# EAGLE design SmartBakerySensor (EAGLE 9.6.2)
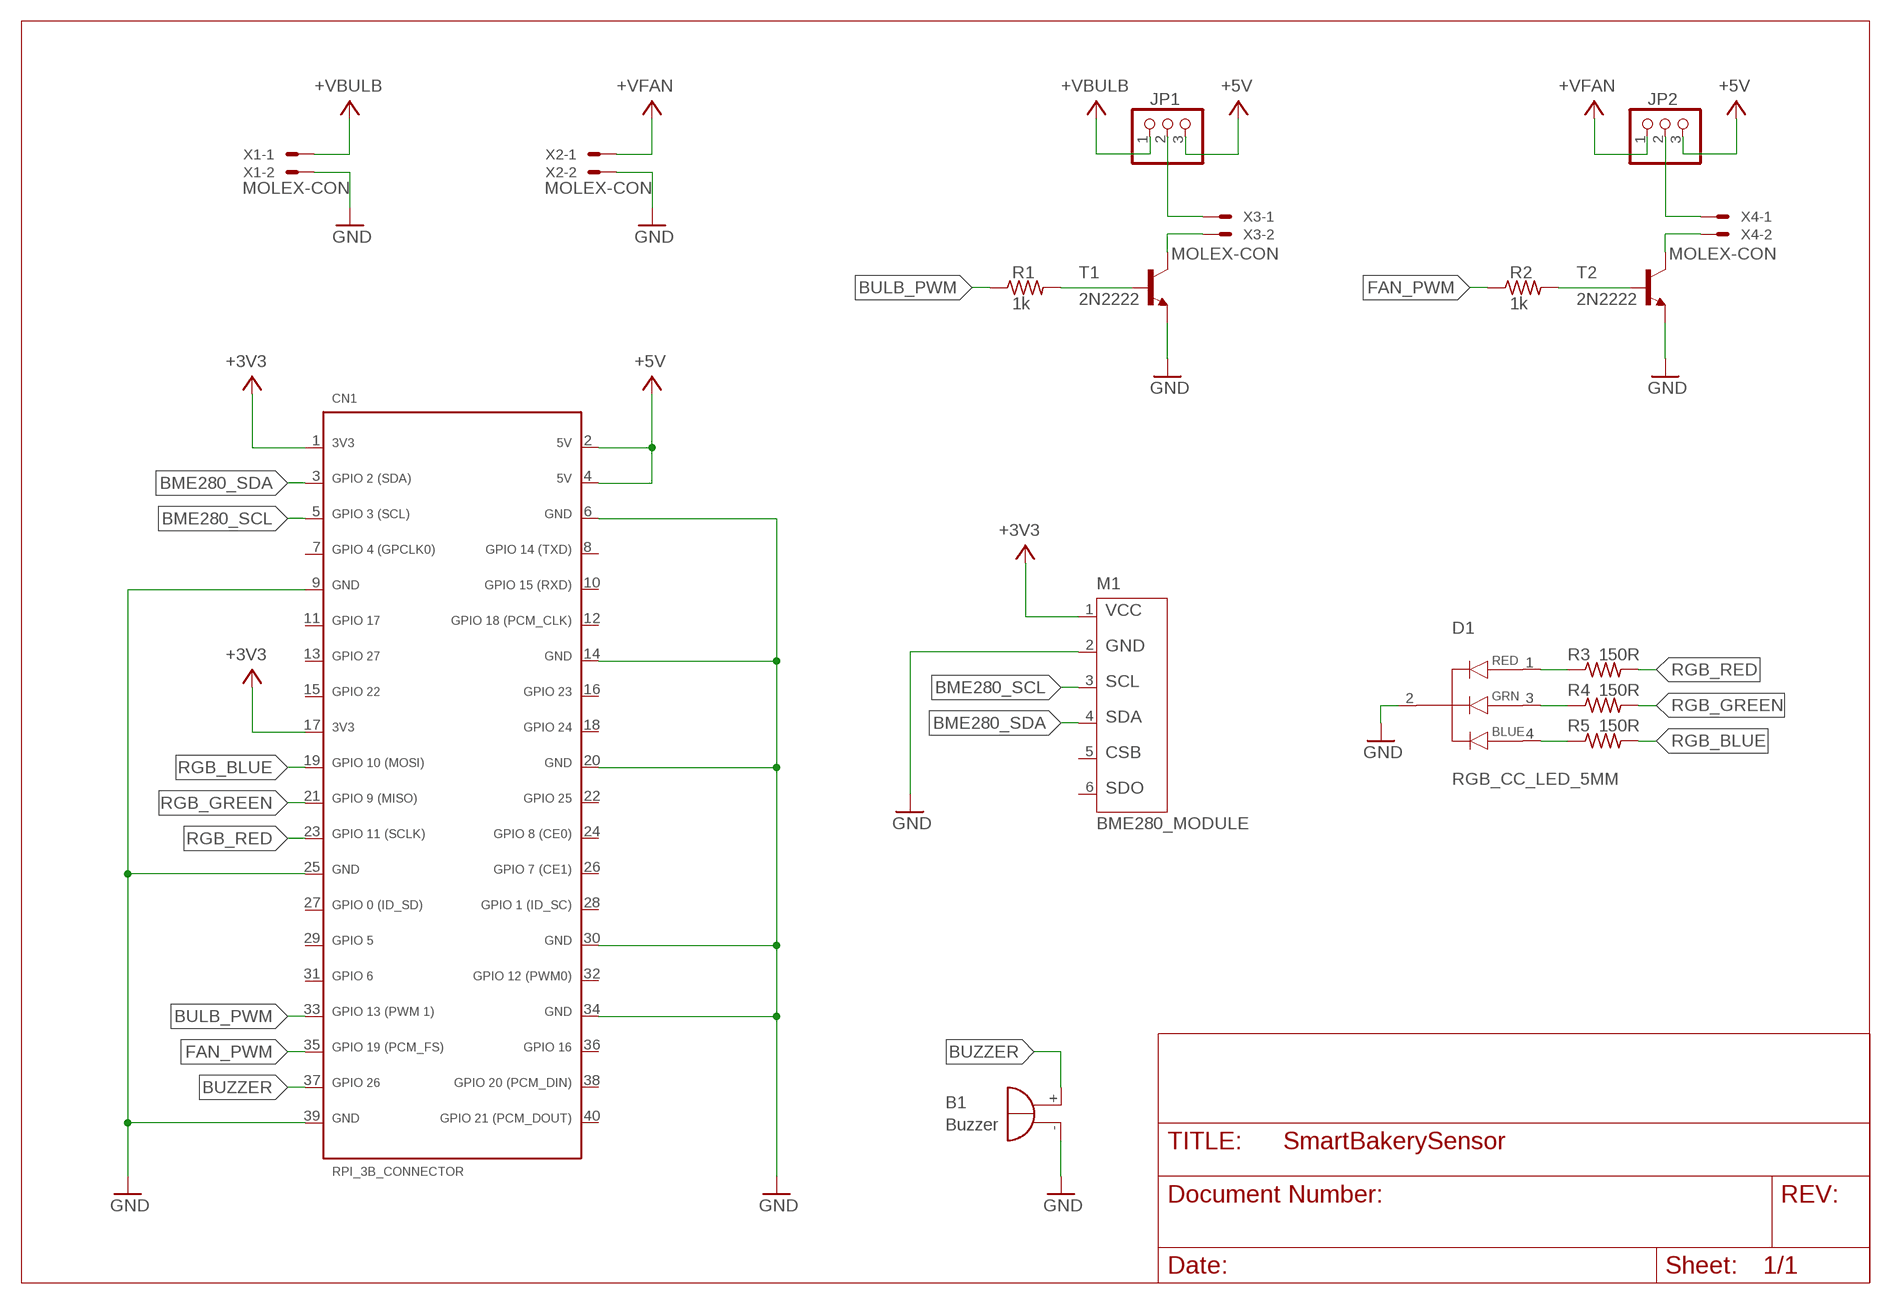
[diagram p0: schematic, sheet 1]

## Parts
B1  Buzzer  F/TMB  [F/TMB]
CN1  RPI_3B_CONNECTOR  [RPI_3B_CONNECTOR_FOOTPRINT]
D1  RGB_CC_LED_5MM  [RGB_CC_LED_FOOTPRINT]
JP1  PINHD-1X3  [1X03]
JP2  PINHD-1X3  [1X03]
M1  BME280_MODULE  [BME280_FOOTPRINT]
R1  1k  R-US_R0805  [R0805]
R2  1k  R-US_R0805  [R0805]
R3  150R  R-US_R0805  [R0805]
R4  150R  R-US_R0805  [R0805]
R5  150R  R-US_R0805  [R0805]
T1  2N2222  2N2222-NPN-TO92-EBC  [TO92-EBC]
T2  2N2222  2N2222-NPN-TO92-EBC  [TO92-EBC]
X1  MOLEX-CON  22-23-2021  [22-23-2021]
X2  MOLEX-CON  22-23-2021  [22-23-2021]
X3  MOLEX-CON  22-23-2021  [22-23-2021]
X4  MOLEX-CON  22-23-2021  [22-23-2021]

## Nets
+3V3: CN1.1 CN1.17 M1.1
+5V: CN1.2 CN1.4 JP1.3 JP2.3
BME280_SCL: CN1.5 M1.3
BME280_SDA: CN1.3 M1.4
BULB_PWM: CN1.33 R1.1
BUZZER: B1.+ CN1.37
FAN_PWM: CN1.35 R2.1
GND: B1.- CN1.6 CN1.9 CN1.14 CN1.20 CN1.25 CN1.30 CN1.34 CN1.39 D1.2 M1.2 T1.E T2.E X1.2 X2.2
N$1: D1.1 R3.1
N$2: D1.3 R4.1
N$3: D1.4 R5.1
N$4: R2.2 T2.B
N$5: R1.2 T1.B
N$6: T1.C X3.2
N$7: T2.C X4.2
N$8: JP1.2 X3.1
N$9: JP2.2 X4.1
RGB_BLUE: CN1.19 R5.2
RGB_GREEN: CN1.21 R4.2
RGB_RED: CN1.23 R3.2
V+: JP2.1 X2.1 ; supply symbol labelled +VFAN
VCC: JP1.1 X1.1 ; supply symbol labelled +VBULB
Unconnected: CN1.7 CN1.8 CN1.10 CN1.11 CN1.12 CN1.13 CN1.15 CN1.16 CN1.18 CN1.22 CN1.24 CN1.26 CN1.27 CN1.28 CN1.29 CN1.31 CN1.32 CN1.36 CN1.38 CN1.40 M1.5 M1.6

## Library data of the parts
B1 = buzzer:F/TMB: BUZZER Source: Buerklin; OC_FARNELL: unknown; OC_NEWARK: unknown
CN1 = RPI_3B_Connector:RPI_3B_CONNECTOR
D1 = RGB_CC_LED_5MM:RGB_CC_LED_5MM
JP1 JP2 = pinhead:PINHD-1X3: PIN HEADER
M1 = BME280_Module:BME280_MODULE
R1-R5 = rcl:R-US_: RESISTOR, American symbol; SPICEPREFIX: R
T1 T2 = transistor-neu-to92:*-NPN-: NPN Transistror
X1-X4 = con-molex:22-23-2021: .100" (2.54mm) Center Header - 2 Pin; MF: MOLEX; MPN: 22-23-2021; OC_FARNELL: 1462926; OC_NEWARK: 25C3832

## Board
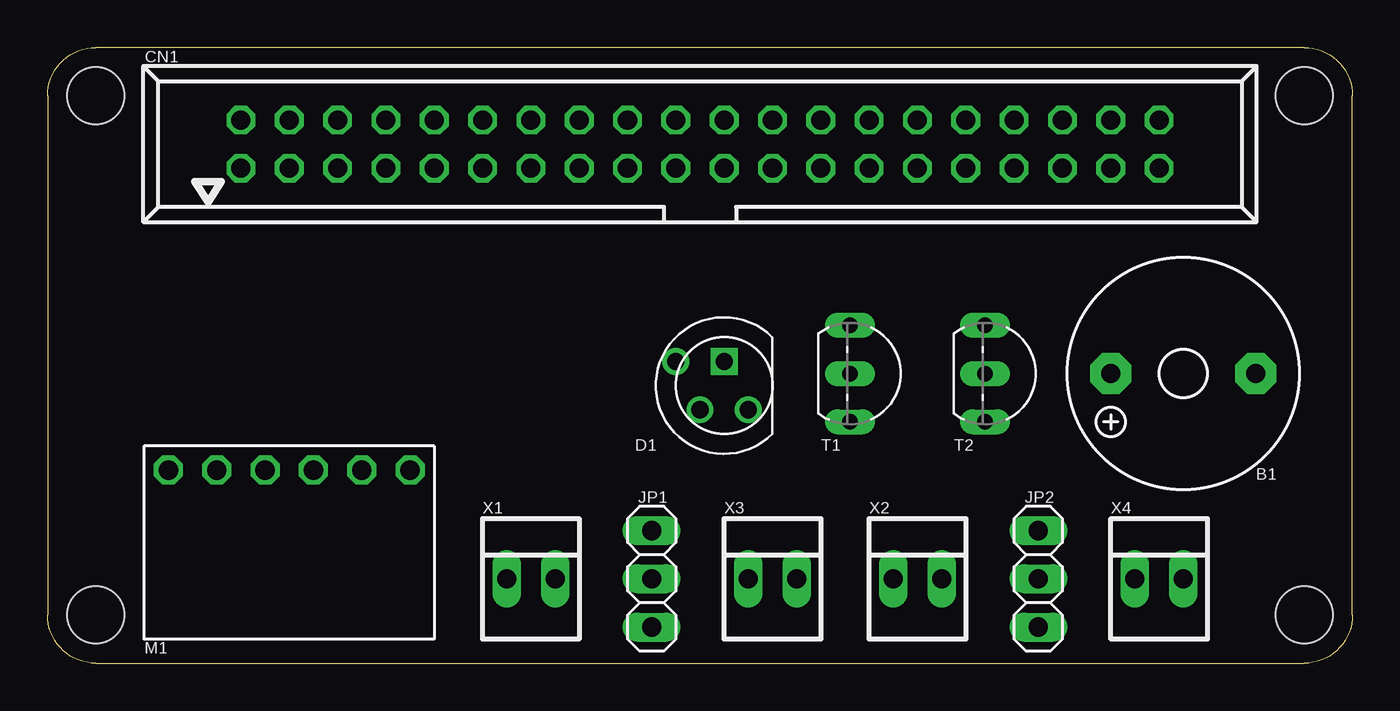
[diagram p1: board, top side]
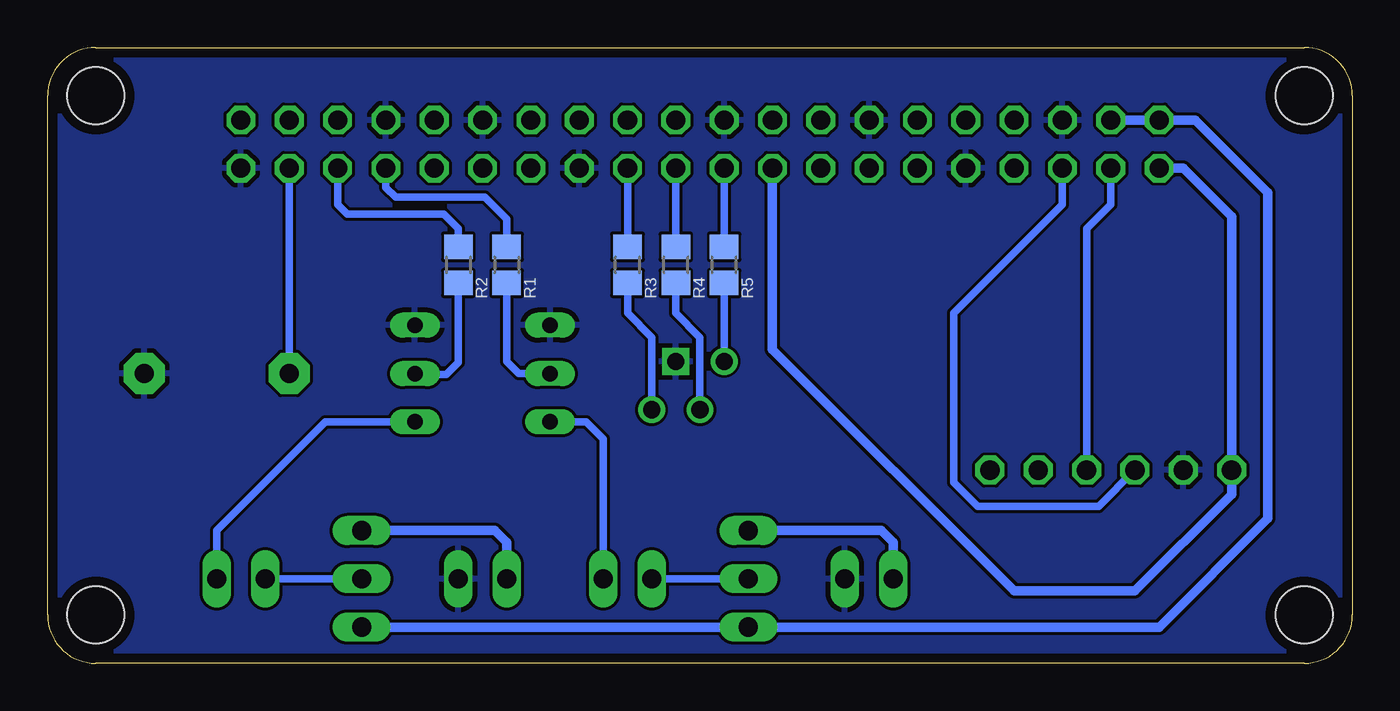
[diagram p2: board, bottom side, seen from below]

Size 68.58 x 32.38 mm. Coordinates in mm from the lower left corner, seen from the top.
Outline: 2.54,0 66.04,0 arc90 68.58,2.54 68.58,29.84 arc90 66.04,32.38 2.54,32.38 arc90 0,29.84 0,2.54 arc90 2.54,0
Copper layers (1*16): Top 0.035mm / dielectric 1.5mm / Bottom 0.035mm
Design rules "default *": minimum track width 6mil, minimum drill 0.35mm, track to track 6mil, track to pad 6mil, pad to pad 6mil, via to via 6mil, smd to smd 6mil, copper to edge 20mil, drill to drill 6mil, minimum pad ring 10mil, minimum via ring 8mil, stop-mask expansion 4mil, vias tented up to drill 0mil, thermal gap 10mil
Holes 3 mm at 2.54,29.84 2.54,2.54 66.04,2.54 66.04,29.84

### Footprints (pad centres in the part's own frame; a part is rotated, then mirrored left to right if it is on the bottom)
F/TMB = drill 1.016 pad 2.159 octagon: + 3.81,0; - -3.81,0
RPI_3B_CONNECTOR_FOOTPRINT = drill 1 octagon: 1 24.13,1.27; 2 24.13,-1.27; 3 21.59,1.27; 4 21.59,-1.27; 5 19.05,1.27; 6 19.05,-1.27; 7 16.51,1.27; 8 16.51,-1.27; 9 13.97,1.27; 10 13.97,-1.27; 11 11.43,1.27; 12 11.43,-1.27; 13 8.89,1.27; 14 8.89,-1.27; 15 6.35,1.27; 16 6.35,-1.27; 17 3.81,1.27; 18 3.81,-1.27; 19 1.27,1.27; 20 1.27,-1.27; 21 -1.27,1.27; 22 -1.27,-1.27; 23 -3.81,1.27; 24 -3.81,-1.27; 25 -6.35,1.27; 26 -6.35,-1.27; 27 -8.89,1.27; 28 -8.89,-1.27; 29 -11.43,1.27; 30 -11.43,-1.27; 31 -13.97,1.27; 32 -13.97,-1.27; 33 -16.51,1.27; 34 -16.51,-1.27; 35 -19.05,1.27; 36 -19.05,-1.27; 37 -21.59,1.27; 38 -21.59,-1.27; 39 -24.13,1.27; 40 -24.13,-1.27
RGB_CC_LED_FOOTPRINT = drill 0.9: 1 -3.81,2.54; 3 -1.27,2.54; 4 0,0 | drill 0.9 square: 2 -2.54,0
1X03 = drill 1.016 long: 1 -2.54,0; 2 0,0; 3 2.54,0
BME280_FOOTPRINT = drill 1.016 octagon: 1 3.81,6.35; 2 3.81,3.81; 3 3.81,1.27; 4 3.81,-1.27; 5 3.81,-3.81; 6 3.81,-6.35
R0805 = smd 1.3 x 1.5: 1 -0.95,0; 2 0.95,0
TO92-EBC = drill 0.813 long: B 0,-1.27; C 2.54,-1.27; E -2.54,-1.27
22-23-2021 = drill 1 long: 1 -1.27,0; 2 1.27,0

### Placement (x,y rotation side)
B1  59.69,15.24 180 top
CN1  34.29,27.3 180 top
D1  33.02,15.88 180 top
JP1  31.75,4.45 270 top
JP2  52.07,4.45 270 top
M1  12.7,6.35 90 top
R1  44.45,20.95 270 bottom
R2  46.99,20.95 270 bottom
R3  38.1,20.95 90 bottom
R4  35.56,20.95 90 bottom
R5  33.02,20.95 90 bottom
T1  43.43,15.24 270 top
T2  50.55,15.24 270 top
X1  25.4,4.45 0 top
X2  45.72,4.45 0 top
X3  38.1,4.45 0 top
X4  58.42,4.45 0 top

### Tracks (layer width: path | path; a pad name or v marks a point on that pad's centre or on a via)
+3V3
  Bottom 0.508: CN1.1 8.89,26.04 6.35,23.5 M1.1 6.35,8.89 11.43,3.81 17.78,3.81 30.48,16.51 CN1.17
+5V
  Bottom 0.508: CN1.4 CN1.2 8.26,28.57 4.45,24.77 4.45,7.62 10.16,1.91 JP1.3 JP2.3
BME280_SCL
  Bottom 0.406: M1.3 13.34,8.26 19.68,8.26 20.95,9.53 20.95,18.41 15.24,24.13 CN1.5
BME280_SDA
  Bottom 0.406: M1.4 13.97,22.86 12.7,24.13 CN1.3
BULB_PWM
  Bottom 0.406: R1.1 44.45,23.37 45.59,24.51 50.29,24.51 50.8,25.02 CN1.33
BUZZER
  Bottom 0.406: CN1.37 B1.+
FAN_PWM
  Bottom 0.406: R2.1 46.99,22.86 47.75,23.62 52.83,23.62 53.34,24.13 CN1.35
GND
  pour Bottom: -0.64,-0.64 69.22,-0.64 69.22,33.02 -0.64,33.02
N$1
  Bottom 0.406: D1.1 36.83,17.14 38.1,18.41 R3.1
N$2
  Bottom 0.406: D1.3 34.29,17.14 35.56,18.41 R4.1
N$3
  Bottom 0.406: R5.1 D1.4
N$4
  Bottom 0.406: R2.2 46.99,15.81 47.62,15.18 49.22,15.18 T2.B
N$5
  Bottom 0.406: R1.2 44.45,15.88 43.81,15.24 T1.B
N$6
  Bottom 0.406: T1.C 40.26,12.7 39.37,11.81 X3.2
N$7
  Bottom 0.406: T2.C 53.98,12.7 59.69,6.99 X4.2
N$8
  Bottom 0.406: JP1.2 X3.1
N$9
  Bottom 0.406: X4.1 JP2.2
RGB_BLUE
  Bottom 0.406: CN1.19 R5.2
RGB_GREEN
  Bottom 0.406: CN1.21 R4.2
RGB_RED
  Bottom 0.406: CN1.23 R3.2
V+
  Bottom 0.508: X2.1 44.45,6.35 45.09,6.99 JP2.1
VCC
  Bottom 0.508: X1.1 24.13,6.35 24.77,6.99 JP1.1